# EAGLE schematic LCD Board (EAGLE 9.6.2)
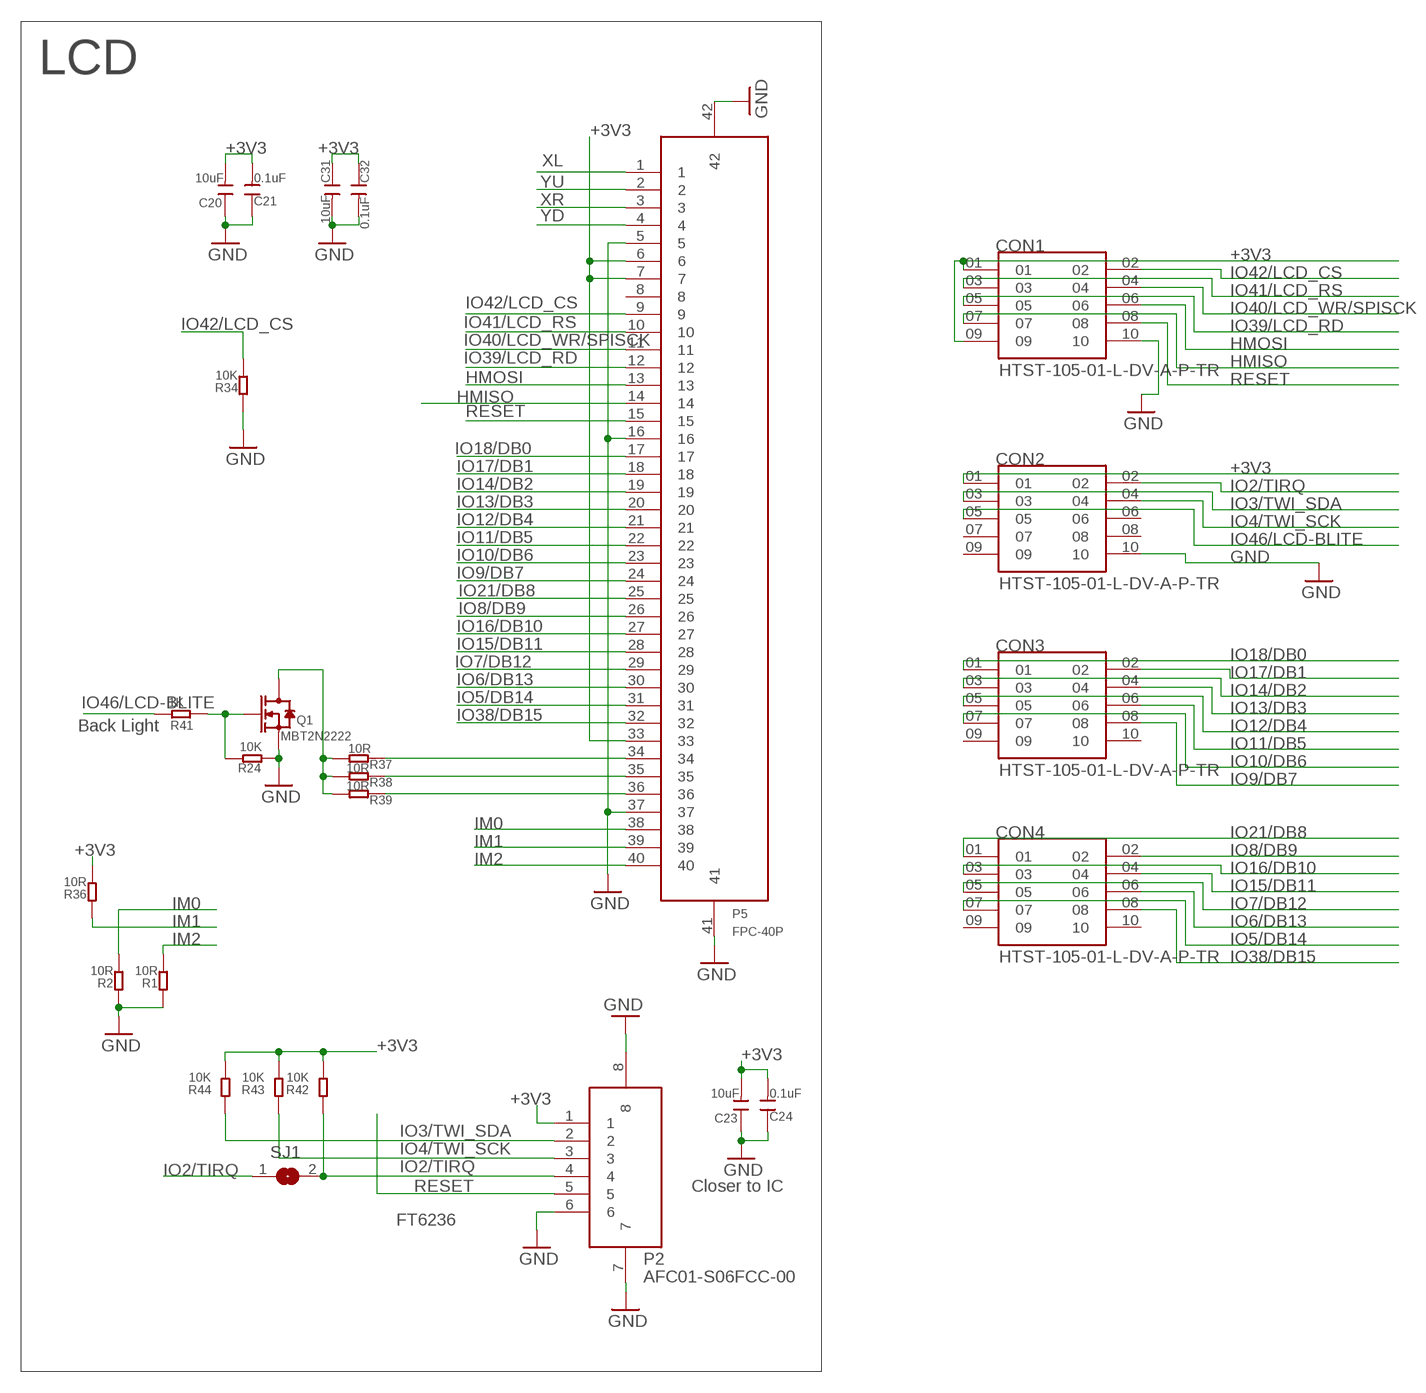
[diagram p0: schematic, sheet 1]

## Parts
C20  10uF  DISCRETE_C-1206  [DISCRETE_C1206]
C21  0.1uF  DISCRETE_C-0603  [DISCRETE_C0603]
C23  10uF  DISCRETE_C-1206  [DISCRETE_C1206]
C24  0.1uF  DISCRETE_C-0603  [DISCRETE_C0603]
C31  10uF  DISCRETE_C-1206  [DISCRETE_C1206]
C32  0.1uF  DISCRETE_C-0603  [DISCRETE_C0603]
CON1  HTST-105-01-L-DV-A-P-TR  [SAMTEC_HTST-105-01-L-DV-A-P-TR]
CON2  HTST-105-01-L-DV-A-P-TR  [SAMTEC_HTST-105-01-L-DV-A-P-TR]
CON3  HTST-105-01-L-DV-A-P-TR  [SAMTEC_HTST-105-01-L-DV-A-P-TR]
CON4  HTST-105-01-L-DV-A-P-TR  [SAMTEC_HTST-105-01-L-DV-A-P-TR]
P2  AFC01-S06FCC-00  [SMD8-50P-740L535W]
P5  FPC-40P  [SMD42-50P-2560L490W]
Q1  MBT2N2222  MOSFET-N'SOT23'  [SOT23@1]
R1  10R  DISCRETE_R-0603  [DISCRETE_R0603]
R2  10R  DISCRETE_R-0603  [DISCRETE_R0603]
R24  10K  DISCRETE_R-0603  [DISCRETE_R0603]
R34  10K  DISCRETE_R-0603  [DISCRETE_R0603]
R36  10R  DISCRETE_R-0603  [DISCRETE_R0603]
R37  10R  DISCRETE_R-0603  [DISCRETE_R0603]
R38  10R  DISCRETE_R-0603  [DISCRETE_R0603]
R39  10R  DISCRETE_R-0603  [DISCRETE_R0603]
R41  1K  DISCRETE_R-0603  [DISCRETE_R0603]
R42  10K  DISCRETE_R-0603  [DISCRETE_R0603]
R43  10K  DISCRETE_R-0603  [DISCRETE_R0603]
R44  10K  DISCRETE_R-0603  [DISCRETE_R0603]
SJ1  SJ  [SJ]

## Nets
+3V3: C20.2 C21.2 C23.2 C24.2 C31.1 C32.1 CON1.01 CON1.09 CON2.01 P2.1 P5.6 P5.7 P5.33 R36.2 R42.2 R43.2 R44.2
GND: C20.1 C21.1 C23.1 C24.1 C31.2 C32.2 CON1.10 CON2.10 P2.6 P2.7 P2.8 P5.5 P5.16 P5.37 P5.41 P5.42 Q1.2(S) R1.1 R2.1 R24.1 R34.1
HMISO: CON1.07 P5.14
HMOSI: CON1.06 P5.13
IM0: P5.38 R2.2
IM1: P5.39 R36.1
IM2: P5.40 R1.2
IO2/TIRQ: CON2.02 P2.4 R42.1 SJ1.1 SJ1.2
IO3/TWI_SDA: CON2.03 P2.2 R44.1
IO4/TWI_SCK: CON2.04 P2.3 R43.1
IO5/DB14: CON4.07 P5.31
IO6/DB13: CON4.06 P5.30
IO7/DB12: CON4.05 P5.29
IO8/DB9: CON4.02 P5.26
IO9/DB7: CON3.08 P5.24
IO10/DB6: CON3.07 P5.23
IO11/DB5: CON3.06 P5.22
IO12/DB4: CON3.05 P5.21
IO13/DB3: CON3.04 P5.20
IO14/DB2: CON3.03 P5.19
IO15/DB11: CON4.04 P5.28
IO16/DB10: CON4.03 P5.27
IO17/DB1: CON3.02 P5.18
IO18/DB0: CON3.01 P5.17
IO21/DB8: CON4.01 P5.25
IO38/DB15: CON4.08 P5.32
IO39/LCD_RD: CON1.05 P5.12
IO40/LCD_WR/SPISCK: CON1.04 P5.11
IO41/LCD_RS: CON1.03 P5.10
IO42/LCD_CS: CON1.02 P5.9 R34.2
IO46/LCD-BLITE: CON2.05 R41.2
N$20: P5.34 R37.1
N$21: P5.35 R38.1
N$22: P5.36 R39.1
N$23: Q1.1(G) R24.2 R41.1
N$24: Q1.3(D) R37.2 R38.2 R39.2
RESET: CON1.08 P2.5 P5.15
XL: P5.1
XR: P5.3
YD: P5.4
YU: P5.2
Unconnected: CON2.06 CON2.07 CON2.08 CON2.09 CON3.09 CON3.10 CON4.09 CON4.10 P5.8

## Notes on the sheet
- LCD
- Back Light
- Closer to IC
- FT6236

## Library data of the parts
C20 C21 C23 C24 C31 C32 = A9G:DISCRETE_C*: Ceramic Capacitors
CON1-CON4 = HTST-105-01-L-DV-A-P-TR:HTST-105-01-L-DV-A-P-TR: Check availability <https://pricing.snapeda.com/parts/HTST-105-01-L-DV-A-P/Samtec/view-part?ref=eda>; AVAILABILITY: In Stock; CHECK_PRICES: https://www.snapeda.com/parts/HTST-105-01-L-DV-A-P/Samtec/view-part/?ref=eda; DESCRIPTION: Connector Header Surface Mount 10 position 0.100 (2.54mm); MF: Samtec; MP: HTST-105-01-L-DV-A-P; PACKAGE: None; PRICE: None; SNAPEDA_LINK: https://www.snapeda.com/parts/HTST-105-01-L-DV-A-P/Samtec/view-part/?ref=snap
P2 = self:AFC01-S06FCC-00
P5 = self:FPC-40P
Q1 = discrete:MOSFET-N: IRLL014: http://www.vishay.com/docs/91319/sihll014.pdf
R1 R2 R24 R34 R36-R39 R41-R44 = A9G:DISCRETE_R*
SJ1 = jumper:SJ: SMD solder JUMPER

## Net classes
0 default: width 0.152 mm, clearance 0.152 mm
1 vbat: width 0.152 mm, drill 0.305 mm, clearance 0.152 mm